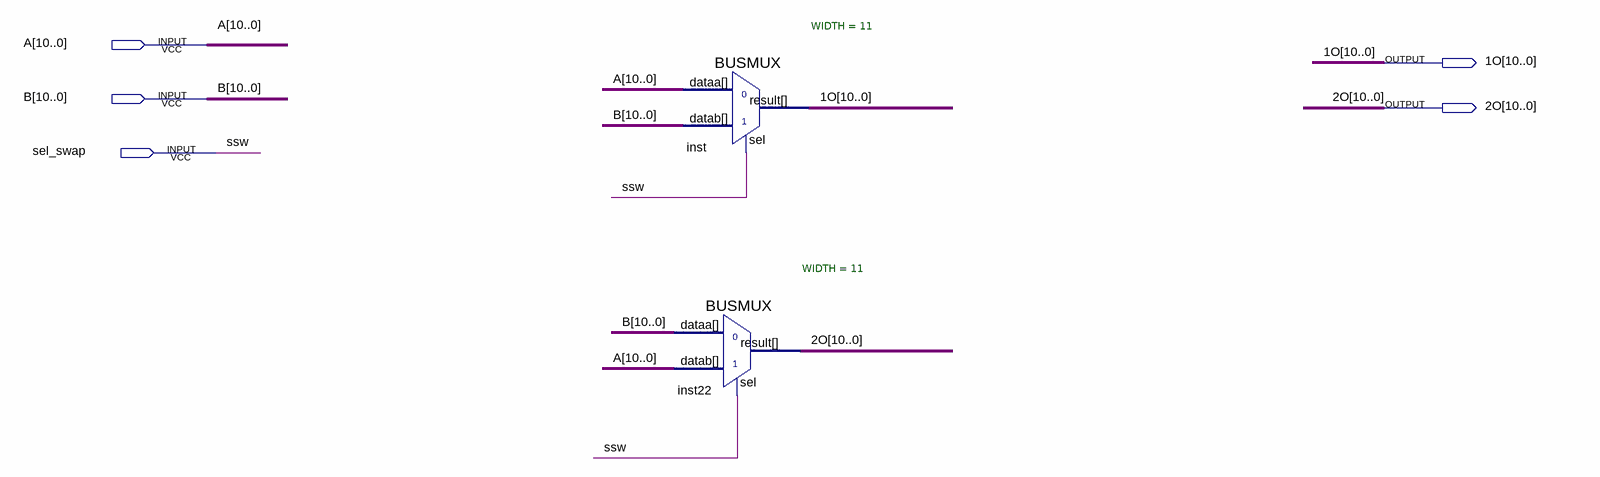
[diagram p0: schematic sheet]
// Quartus schematic swap.bdf as structural Verilog: 2 symbols, 5 pins
module swap (
  input  [10:0] A,
  input  [10:0] B,
  input  sel_swap,
  output [10:0] \1O ,
  output [10:0] \2O 
);

  BUSMUX #(.WIDTH(11)) inst (.datab(B), .sel(sel_swap), .dataa(A), .result(\1O ));
  BUSMUX #(.WIDTH(11)) inst22 (.datab(A), .sel(sel_swap), .dataa(B), .result(\2O ));

  // Other names for the same wires on the sheet: ssw = sel_swap
endmodule
